# EAGLE design ft231x-breakout (EAGLE 6.4)
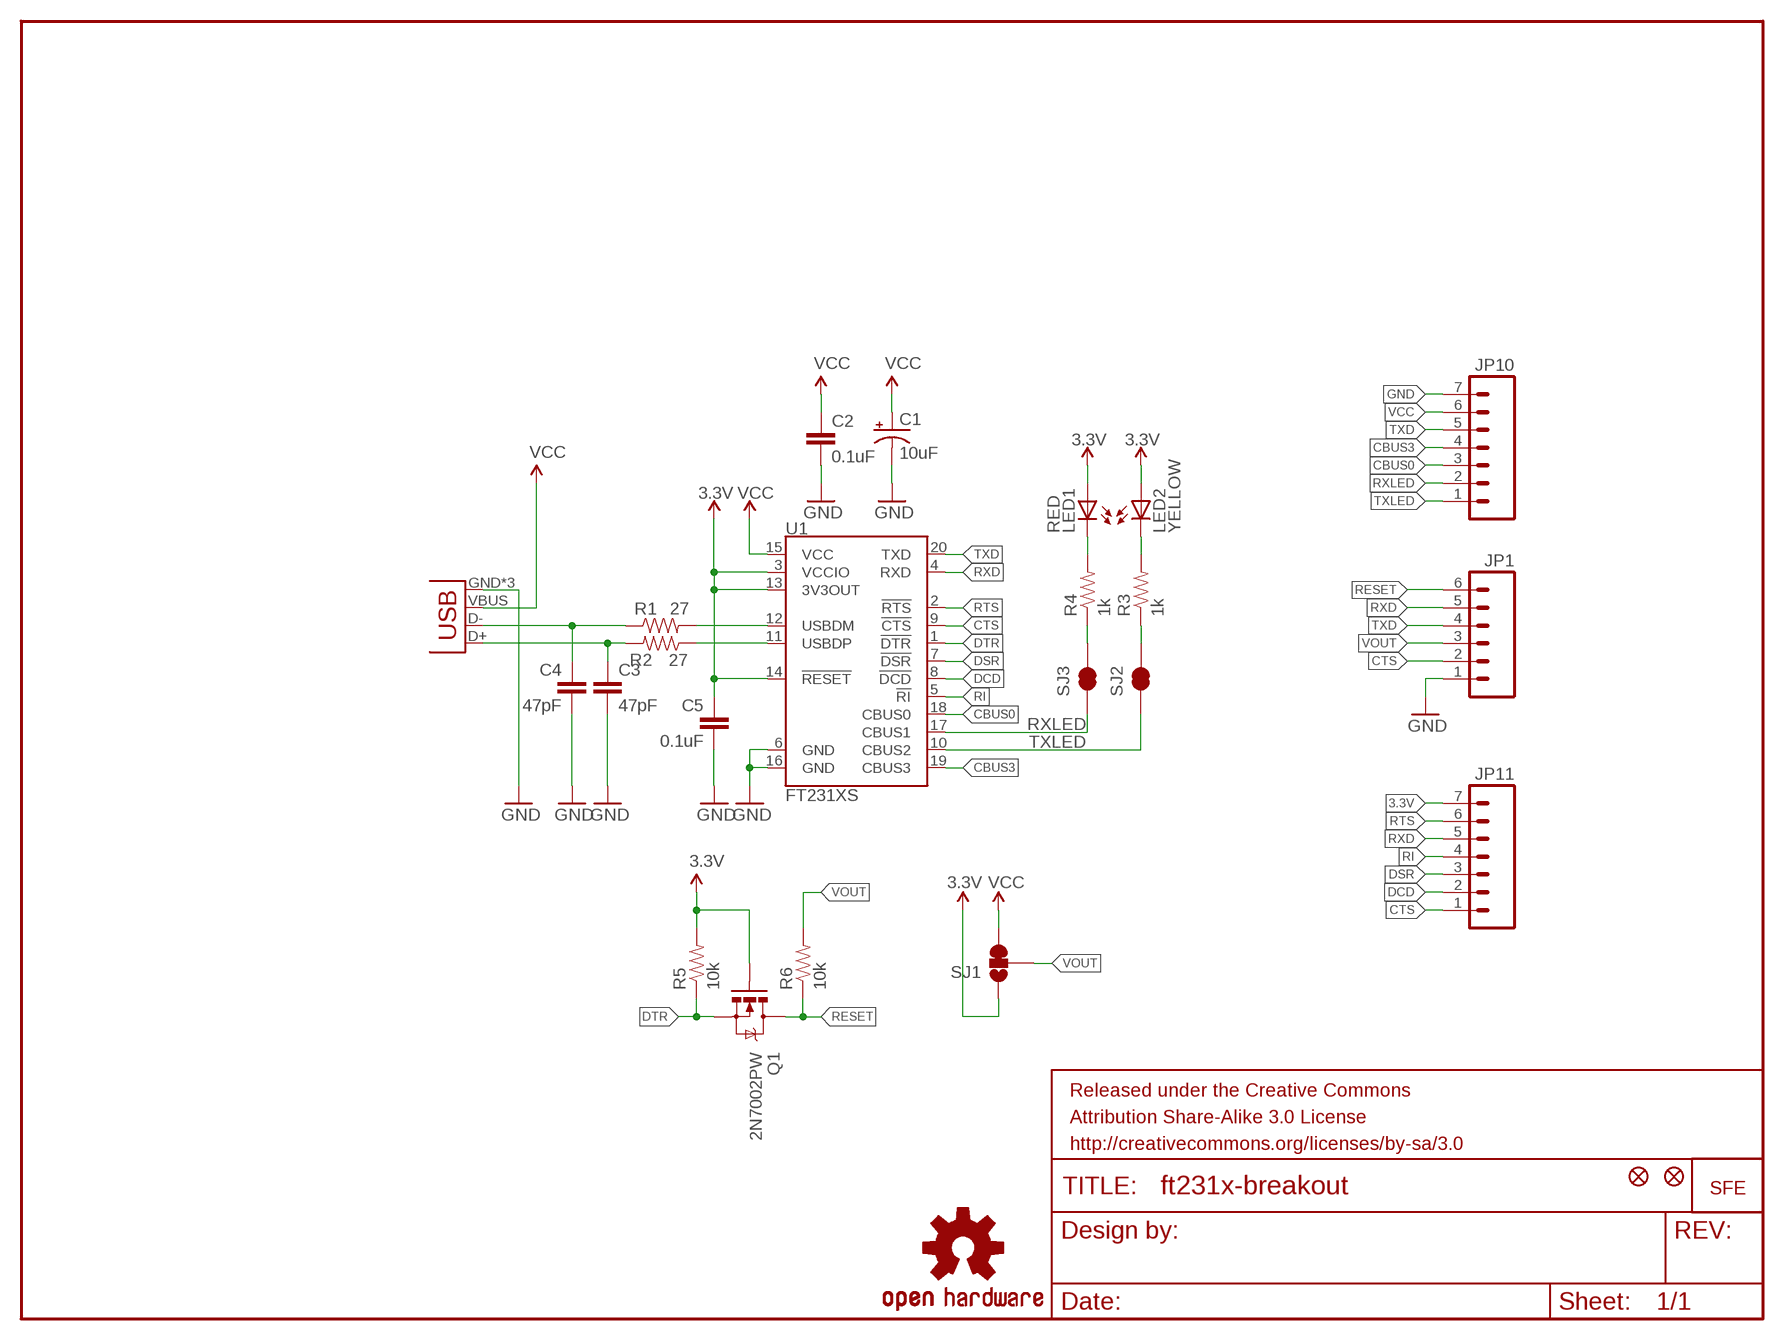
[diagram p0: schematic, sheet 1]

## Parts
C1  10uF  CAP_POL1206  [EIA3216]
C2  0.1uF  CAP0402-CAP  [0402-CAP]
C3  47pF  CAP0402-CAP  [0402-CAP]
C4  47pF  CAP0402-CAP  [0402-CAP]
C5  0.1uF  CAP0402-CAP  [0402-CAP]
FRAME1  FRAME-LETTER  [CREATIVE_COMMONS]
JP1  M06SIP-NS  [1X06_NS]
JP2  LOGO-SFENW2  [SFE-NEW-WEB]
JP3  FIDUCIALUFIDUCIAL  [MICRO-FIDUCIAL]
JP4  FIDUCIALUFIDUCIAL  [MICRO-FIDUCIAL]
JP10  M07NS  [1X07_NS]
JP11  M07NS  [1X07_NS]
LED1  RED  LED0603  [LED-0603]
LED2  YELLOW  LED0603  [LED-0603]
Q1  2N7002PW  MOSFET-NCHANNELSOT323  [SOT323]
R1  27  RESISTOR0402-RES  [0402-RES]
R2  27  RESISTOR0402-RES  [0402-RES]
R3  1k  RESISTOR0402-RES  [0402-RES]
R4  1k  RESISTOR0402-RES  [0402-RES]
R5  10k  RESISTOR0402-RES  [0402-RES]
R6  10k  RESISTOR0402-RES  [0402-RES]
SJ1  SOLDERJUMPER_2WAYS  [SJ_3]
SJ2  TXLED  SOLDERJUMPERTRACE  [SJ_2S-TRACE]
SJ3  RXLED  SOLDERJUMPERTRACE  [SJ_2S-TRACE]
U1  FT231XS  [SSOP20_L]
U$1  OSHW-LOGOS  [OSHW-LOGO-S]
X1  USB-MICROB  [USB-MICROB]

## Nets
3.3V: C5.1 JP11.7 LED1.A LED2.A Q1.1(G) R5.2 SJ1.1 U1.3(VCCIO) U1.13(3V3OUT) U1.14(!RESET)
CBUS0: JP10.3 U1.18(CBUS0)
CBUS3: JP10.4 U1.19(CBUS3)
CTS: JP1.2 JP11.1 U1.9(!CTS)
DCD: JP11.2 U1.8(!DCD)
DSR: JP11.3 U1.7(!DSR)
DTR: Q1.2(S) R5.1 U1.1(!DTR)
GND: C1.C(-) C2.2 C3.2 C4.2 C5.2 JP1.1 JP10.7 U1.6(GND) U1.16(GND) X1.GND X1.MT1(GND) X1.MT2(GND)
N$1: R1.2 U1.12(USBDM)
N$2: R2.1 U1.11(USBDP)
N$3: C3.1 R2.2 X1.D+
N$4: C4.1 R1.1 X1.D-
N$5: LED2.C R3.2
N$6: LED1.C R4.2
N$7: R3.1 SJ2.2
N$8: R4.1 SJ3.2
RESET: JP1.6 Q1.3(D) R6.1
RI: JP11.4 U1.5(!RI)
RTS: JP11.6 U1.2(!RTS)
RXD: JP1.5 JP11.5 U1.4(RXD)
RXLED: JP10.2 SJ3.1 U1.17(CBUS1)
TXD: JP1.4 JP10.5 U1.20(TXD)
TXLED: JP10.1 SJ2.1 U1.10(CBUS2)
VCC: C1.A(+) C2.1 JP10.6 SJ1.3 U1.15(VCC) X1.VBUS
VOUT: JP1.3 R6.2 SJ1.2

## Library data of the parts
C1 = SparkFun-Passives:CAP_POL: Capacitor Polarized These are standard SMD and PTH capacitors. Normally 10uF, 47uF, and 100uF in electrolytic and tantalum varieties. Always verify the external diameter of the through hole cap, it varies with capacity, voltage, and manufacturer. The EIA devices should be standard.
C2-C5 = SparkFun-Capacitors:CAP: Capacitor Standard 0603 ceramic capacitor, and 0.1" leaded capacitor.
FRAME1 = SparkFun-Aesthetics:FRAME-LETTER: Schematic Frame Standard 8.5x11 US Letter frame
JP1 = SparkFun-Connectors:M06: Header 6 Standard 6-pin 0.1" header. Use with straight break away headers (SKU : PRT-00116), right angle break away headers (PRT-00553), swiss pins (PRT-00743), machine pins (PRT-00117), and female headers (PRT-00115). Molex polarized connector foot print use with SKU : PRT-08094 with associated crimp pins and housings. NOTES ON THE VARIANTS LOCK and LOCK_LONGPADS... This footprint was designed to help hold the alignment of a through-hole component (i.e. 6-pin header) while soldering it into place. You may notice that each hole has been shifted either up or down by 0.005 of an inch from it's more standard position (which is a perfectly straight line). This slight alteration caused the pins (the squares in the middle) to touch the edges of the holes. Because they are alternating, it causes a "brace" to hold the component in place. 0.005 has proven to be the perfect amount of "off-center" position when using our standard breakaway headers. Although looks a little odd when you look at the bare footprint, once you have a header in there, the alteration is very hard to notice. Also, if you push a header all the way into place, it is covered up entirely on the bottom side. This idea of altering the position of holes to aid alignment will be further integrated into the Sparkfun Library for other footprints. It can help hold any component with 3 or more connection pins.
JP2 = SparkFun-Aesthetics:LOGO-SFE: Spark Fun Electronics PCB Logo This is the standard Spark Fun Electronics PCB logo.
JP3 JP4 = SparkFun-Aesthetics:FIDUCIAL: Fiducial Alignment Points Various fiducial points for machine vision alignment.
JP10 JP11 = SparkFun-Connectors:M07: Header 7 Standard 7-pin 0.1" header. Use with straight break away headers (SKU : PRT-00116), right angle break away headers (PRT-00553), swiss pins (PRT-00743), machine pins (PRT-00117), and female headers (PRT-00115). NOTES ON THE VARIANTS LOCK and LOCK_LONGPADS... This footprint was designed to help hold the alignment of a through-hole component (i.e. 7-pin header) while soldering it into place. You may notice that each hole has been shifted either up or down by 0.005 of an inch from it's more standard position (which is usually a perfectly straight line). This slight alteration caused the pins (the squares in the middle) to touch the edges of the holes. Because they are alternating, it causes a "brace" to hold the header in place. 0.005 has proven to be the perfect amount of "off-center" position when using our standard breakaway headers. Although looks a little odd when you look at the bare footprint, once you have a header in there, the alteration is very hard to notice. Also, if you push a header all the way into place, it is covered up entirely on the bottom side. This idea of altering the position of holes to aid alignment will be further integrated into the Sparkfun Library for other footprints. It can help hold any component with 3 or more connection pins.
LED1 LED2 = SparkFun-LED:LED: LEDs Standard schematic elements and footprints for 5mm, 3mm, 1206, and 0603 sized LEDs. 5mm - Spark Fun Electronics SKU : COM-00529 (and others)
Q1 = SparkFun-DiscreteSemi:MOSFET-NCHANNEL: Generic NMOS footprint
R1 R2 = SparkFun-Resistors:RESISTOR: Resistor Basic schematic elements and footprints for 0603, 1206, and PTH resistors.
R3-R6 = SparkFun-Passives:RESISTOR: Resistor Basic schematic elements and footprints for 0603, 1206, and PTH resistors.
SJ1 = SparkFun-Passives:SOLDERJUMPER_2WAY: Solder Jumper 2 way solder jumper
SJ2 SJ3 = SparkFun-Passives:SOLDERJUMPER: Solder Jumper Standard SMD solder jumper. Used to automate production. Two varients : Normally Open and Normally Closed are the same, but have different paste layers. NC will have a large amount of paste and should jumper during reflow.
U1 = SparkFun-DigitalIC:FT231X: FTDI FT231X Full Speed USB to Full-handshake UART This USB2.0 Full Speed IC offers a compact bridge to full handshake UART interfaces. The device is a UART, capable of operating up to 3MBaud, with low power consumption (8mA). The FT231X includes the complete FT-X series feature set and enables USB to be added into a system design quickly and easily over a UART interface.
U$1 = SparkFun-Aesthetics:OSHW-LOGO: Open Source Hardware Logo This logo indicates the piece of hardware it is found on incorporates a OSHW license and/or adheres to the definition of open source hardware found here: http://freedomdefined.org/OSHW
X1 = SparkFun-Connectors:USB: USB Connectors USB-B-PTH is fully proven SKU : PRT-00139/CONN-08278 USB-miniB is fully proven SKU : PRT-00587 USB-A-PCB is untested. USB-A-H is throughly reviewed, but untested. Spark Fun Electronics SKU : PRT-00437 USB-B-SMT is throughly reviewed, but untested. Needs silkscreen touching up. USB-A-S has not been used/tested USB-MB-H has not been used/tested USB-MICROB has been used. CONN-09505; PROD_ID: CONN-09505

## Board
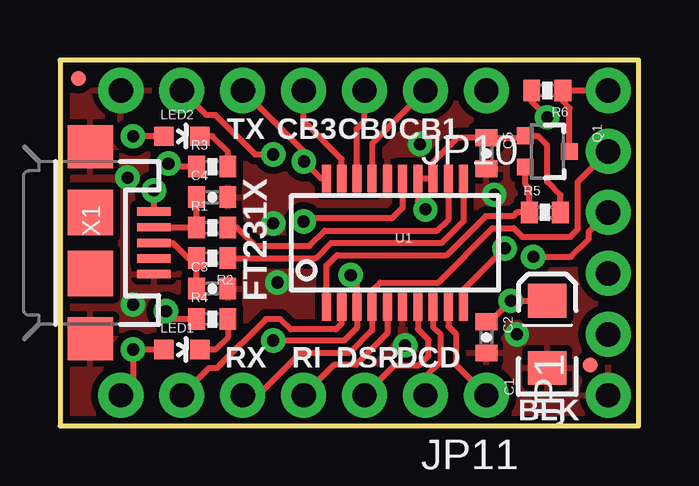
[diagram p1: board, top side]
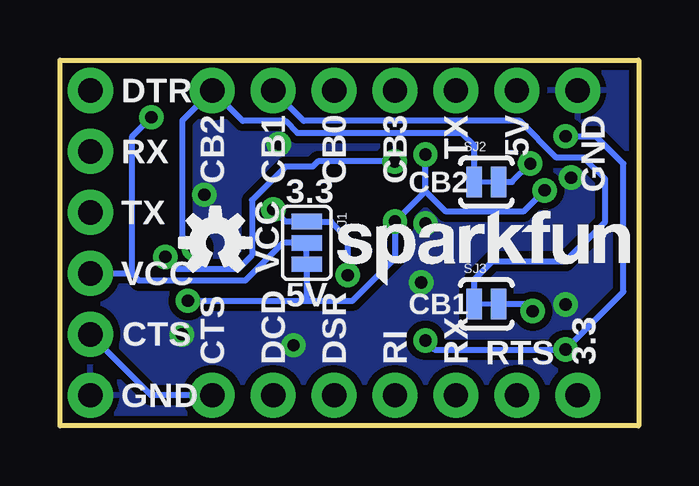
[diagram p2: board, bottom side, seen from below]

Size 24.13 x 15.24 mm. Coordinates in mm from the lower left corner, seen from the top.
Outline: 0,15.24 0,0 24.13,0 24.13,15.24 0,15.24
Copper layers (1*16): Top 0.035mm / dielectric 1.5mm / Bottom 0.035mm
Design rules "SparkFun *": minimum track width 8mil, minimum drill 20mil, track to track 8mil, track to pad 8mil, pad to pad 8mil, via to via 8mil, smd to smd 8mil, copper to edge 8mil, drill to drill 8mil, minimum pad ring 12mil, minimum via ring 10mil, stop-mask expansion 4mil, vias tented up to drill 20mil, thermal gap 10mil

### Footprints (pad centres in the part's own frame; a part is rotated, then mirrored left to right if it is on the bottom)
EIA3216 = smd 1.4 x 1.6: A 1.4,0; C -1.4,0
0402-CAP = smd 0.7 x 0.9: 1 -0.65,0; 2 0.65,0
1X06_NS = drill 1.016 pad 1.88: 1 0,0; 2 2.54,0; 3 5.08,0; 4 7.62,0; 5 10.16,0; 6 12.7,0
MICRO-FIDUCIAL = smd 0.635 x 0.635: 1 0,0
1X07_NS = drill 1.016 pad 1.88: 1 0,0; 2 2.54,0; 3 5.08,0; 4 7.62,0; 5 10.16,0; 6 12.7,0; 7 15.24,0
LED-0603 = smd 0.8 x 0.8: A 0,-0.75; C 0,0.75
SOT323 = smd 0.7 x 0.7: 1 -0.65,-0.925; 2 0.65,-0.925; 3 0,0.925
0402-RES = smd 0.7 x 0.9: 1 -0.65,0; 2 0.65,0
SJ_3 = smd 0.635 x 1.27: 1 -0.889,0; 2 0,0; 3 0.889,0
SJ_2S-TRACE = smd 0.635 x 1.27: 1 -0.508,0; 2 0.508,0
SSOP20_L = smd 0.381 x 1.143: 1 -2.857,-2.68; 2 -2.223,-2.68; 3 -1.587,-2.68; 4 -0.953,-2.68; 5 -0.318,-2.68; 6 0.318,-2.68; 7 0.953,-2.68; 8 1.587,-2.68; 9 2.223,-2.68; 10 2.857,-2.68; 11 2.857,2.68; 12 2.223,2.68; 13 1.587,2.68; 14 0.953,2.68; 15 0.318,2.68; 16 -0.318,2.68; 17 -0.953,2.68; 18 -1.587,2.68; 19 -2.223,2.68; 20 -2.857,2.68
USB-MICROB = smd 0.35 x 1.4: D+ 0,2.65; D- -0.65,2.65; GND 1.3,2.65; ID 0.65,2.65; VBUS -1.3,2.65 | smd 1.8 x 1.9: MT1 -4,0; MT2 4,0 | smd 1.9 x 1.9: P$1 -1.27,0; P$2 1.27,0

### Placement (x,y rotation side)
C1  20.32,3.81 90 top
C2  17.78,3.68 270 top
C3  6.35,5.71 0 top
C4  6.35,9.53 0 top
C5  17.78,11.35 270 top
FRAME1  0,-3.81 0 top  (outside the outline)
JP1  22.86,1.27 90 top
JP2  12.57,5.84 0 bottom
JP3  0.76,14.48 0 top
JP4  22.1,2.54 0 top
JP10  17.78,13.97 180 top
JP11  17.78,1.27 180 top
LED1  5.08,3.17 270 top
LED2  5.08,12.06 270 top
Q1  20.32,11.43 270 top
R1  6.35,8.26 0 top
R2  6.35,6.99 180 top
R3  6.35,10.79 0 top
R4  6.35,4.45 0 top
R5  20.22,8.89 0 top
R6  20.32,13.97 180 top
SJ1  13.84,7.62 270 bottom
SJ2  6.35,10.16 0 bottom
SJ3  6.35,5.08 0 bottom
U1  13.97,7.62 0 top
U$1  17.65,7.62 0 bottom
X1  1.27,7.62 270 top

### Tracks (layer width: path | path; a pad name or v marks a point on that pad's centre or on a via)
3.3V  (via drill 0.51)
  Top 0.254: v15.24,9.02 14.92,9.34 U1.14 U1.13 15.56,10.99 16.58,12 C5.1 19.32,12 Q1.1 19.92,12.08 20.32,11.68 20.32,10.16 20.87,9.61 R5.2 | v8.89,3.56 11.86,3.56 12.38,4.08 U1.3 12.38,6.02 v12.13,6.27 | LED2.A v3.05,12.06 | LED1.A v3.05,3.17 3.05,1.78 JP11.7
  Bottom 0.254: v15.24,9.02 14.73,8.51 SJ1.1 12.83,8.51 12.13,7.81 v12.13,6.27 | v8.89,3.56 8.51,3.17 v3.05,3.17 0.64,5.59 0.64,10.92 1.78,12.06 v3.05,12.06
CBUS0
  Top 0.254: U1.18 12.38,12.38 12.7,12.7 JP10.3
CBUS3
  Top 0.254: U1.19 11.75,11.11 10.16,12.7 JP10.4
CTS
  Top 0.254: U1.9 16.19,4.15 16.51,3.83 16.51,2.54 JP11.1
  Bottom 0.254: JP11.1 20.32,1.27 JP1.2
DCD
  Top 0.254: U1.8 15.56,4.13 15.88,3.81 15.88,2.67 15.24,2.03 JP11.2
DSR
  Top 0.254: U1.7 14.92,4.03 15.37,3.58 15.37,2.92 14.96,2.52 13.95,2.52 JP11.3
DTR
  Top 0.254: U1.1 11.11,6.67 11.56,7.11 16.13,7.11 17.75,8.74 18.9,8.74 19.05,8.89 R5.1 19.57,9.9 19.39,10.07 Q1.2
GND  (via drill 0.51)
  other vias: 15.01,11.73 14.39,3.35 9.07,5.97 3.05,5.05 2.82,10.34 8.89,8.43 18.11,9.63 19.05,3.81
  pour Top (isolate 0.305): 0,15.24 0,0 24.13,0 24.13,15.24
  pour Bottom (isolate 0.305): 0,15.24 0,0 24.13,0 24.13,15.24
N$1
  Top 0.254: U1.12 16.19,8.57 15.75,8.13 11.05,8.13 10.41,7.49 8.13,7.49 7.37,8.26 R1.2
N$2
  Top 0.254: U1.11 16.83,8.52 15.93,7.62 11.3,7.62 10.67,6.99 R2.1
N$3
  Top 0.254: X1.D+ 4.7,7.62 5.33,6.99 R2.2 C3.1
N$4
  Top 0.254: X1.D- 5.68,8.27 R1.1 C4.1
N$5
  Top 0.254: R3.2 7,11.41 6.35,12.06 LED2.C
N$6
  Top 0.254: 7.1,4.34 R4.2 7,3.7 6.48,3.17 LED1.C
N$7  (via drill 0.51)
  Top 0.254: R3.1 4.65,10.79 v4.52,10.92
  Bottom 0.254: SJ2.2 5.28,10.16 v4.52,10.92
N$8  (via drill 0.51)
  Top 0.254: R4.1 4.75,4.45 v4.42,4.78
  Bottom 0.254: SJ3.2 4.72,5.08 v4.42,4.78
N$9
  Bottom 0.254: 13.84,6.73 13.84,7.49
RESET
  Top 0.254: JP1.6 R6.1 20.97,13.51 21.25,13.24 Q1.3
RI
  Top 0.254: U1.5 13.65,3.85 12.34,2.54 11.43,2.54 JP11.4
RTS
  Top 0.254: U1.2 11.75,4.25 11.51,4.01 9.63,4.01 9.2,4.45 8.59,4.45 6.55,2.41 6.22,2.41 JP11.6
RXD
  Top 0.254: JP11.5 8.26,1.27 10.03,3.05 12.09,3.05 13.02,3.98 U1.4 13.02,5.63 13.36,5.97 15.77,5.97 18.03,8.23 18.92,8.23 19.28,7.87 21.29,7.87 21.59,8.18 21.59,10.16 JP1.5
RXLED
  Top 0.254: JP10.2 13.02,11.75 U1.17
  Bottom 0.254: SJ3.1 6.86,6.1 6.1,6.86 3.05,6.86 1.4,8.51 1.4,10.29 2.29,11.18 3.43,11.18 4.95,12.7 13.97,12.7 JP10.2
TXD  (via drill 0.51)
  Top 0.254: JP10.5 10.17,11.42 v10.17,11.01 10.88,10.3 U1.20 | v19.74,7.04 21.31,7.04 22.05,7.77 22.05,8.08 JP1.4
  Bottom 0.254: v10.17,11.01 13.37,11.01 13.59,10.79 14.73,10.79 16.13,9.4 16.13,7.11 16.71,6.53 19.23,6.53 v19.74,7.04
TXLED  (via drill 0.51)
  Top 0.254: U1.10 16.83,5.68 v18.54,7.39
  Bottom 0.254: v18.54,7.39 19.02,7.87 19.02,12.72 JP10.1 16.51,12.7 14.73,12.7 14.22,12.19 7.37,12.19 6.86,11.68 SJ2.1
VCC  (via drill 0.51)
  Top 0.254: U1.15 14.29,9.08 13.84,8.64 10.29,8.64 v10.16,8.51 | X1.VBUS v3.92,9.81 | JP10.6 6.1,12.95 6.48,12.95 8.13,11.3 v8.89,11.3 | C1.A v18.8,5.21 17.92,4.33 C2.1
  Bottom 0.254: v18.8,5.21 13.84,5.21 | 13.84,5.21 11.94,5.21 10.16,6.99 v10.16,8.51 8.89,9.78 | SJ1.3 13.84,5.21 | 8.89,9.78 v8.89,11.3 | 8.89,9.78 8.03,8.92 4.81,8.92 v3.92,9.81
VOUT  (via drill 0.51)
  Top 0.254: R6.2 19.67,13.5 v20.32,12.85
  Bottom 0.254: JP1.3 21.13,6.35 | SJ1.2 14.83,7.62 16.41,6.04 20.83,6.04 21.13,6.35 | v20.32,12.85 21.13,12.04 21.13,6.35

### Text on the board
tPlace: TX | CB3 | CB0 | CB1 | FT231X | RX | RI | DSR | DCD | BLK
bPlace: DTR | GND | 5V | TX | CB3 | CB0 | CB1 | CB2 | RX | CB2 | 3.3 | TX | 5V | VCC | VCC | CB1 | CTS | 3.3 | RTS | RX | RI | DSR | DCD | CTS | GND